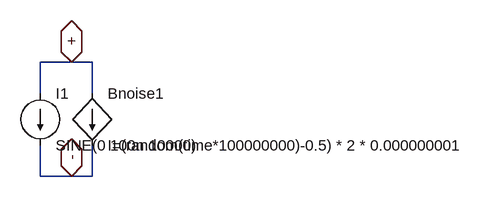
[diagram p0: schematic Noise.asc]
Noise.asc, the LTspice schematic file:
Version 4
SHEET 1 880 680
WIRE -16 80 -64 80
WIRE 16 80 -16 80
WIRE -64 128 -64 80
WIRE 16 128 16 80
WIRE -64 256 -64 208
WIRE -16 256 -64 256
WIRE 16 256 16 208
WIRE 16 256 -16 256
FLAG -16 80 +
IOPIN -16 80 BiDir
FLAG -16 256 -
IOPIN -16 256 BiDir
SYMBOL bi 16 128 R0
SYMATTR InstName Bnoise1
SYMATTR Value I=(random(time*100000000)-0.5) * 2 * 0.000000001
SYMBOL current -64 128 R0
WINDOW 123 24 108 Left 2
WINDOW 39 0 0 Left 2
SYMATTR InstName I1
SYMATTR Value SINE(0 100n 10000)

The netlist it stands for:
* Noise.asc
Bnoise1 + - I=(random(time*100000000)-0.5) * 2 * 0.000000001
I1 + - SINE(0 100n 10000)
.backanno
.end